# EAGLE schematic carberry (EAGLE 6.4)
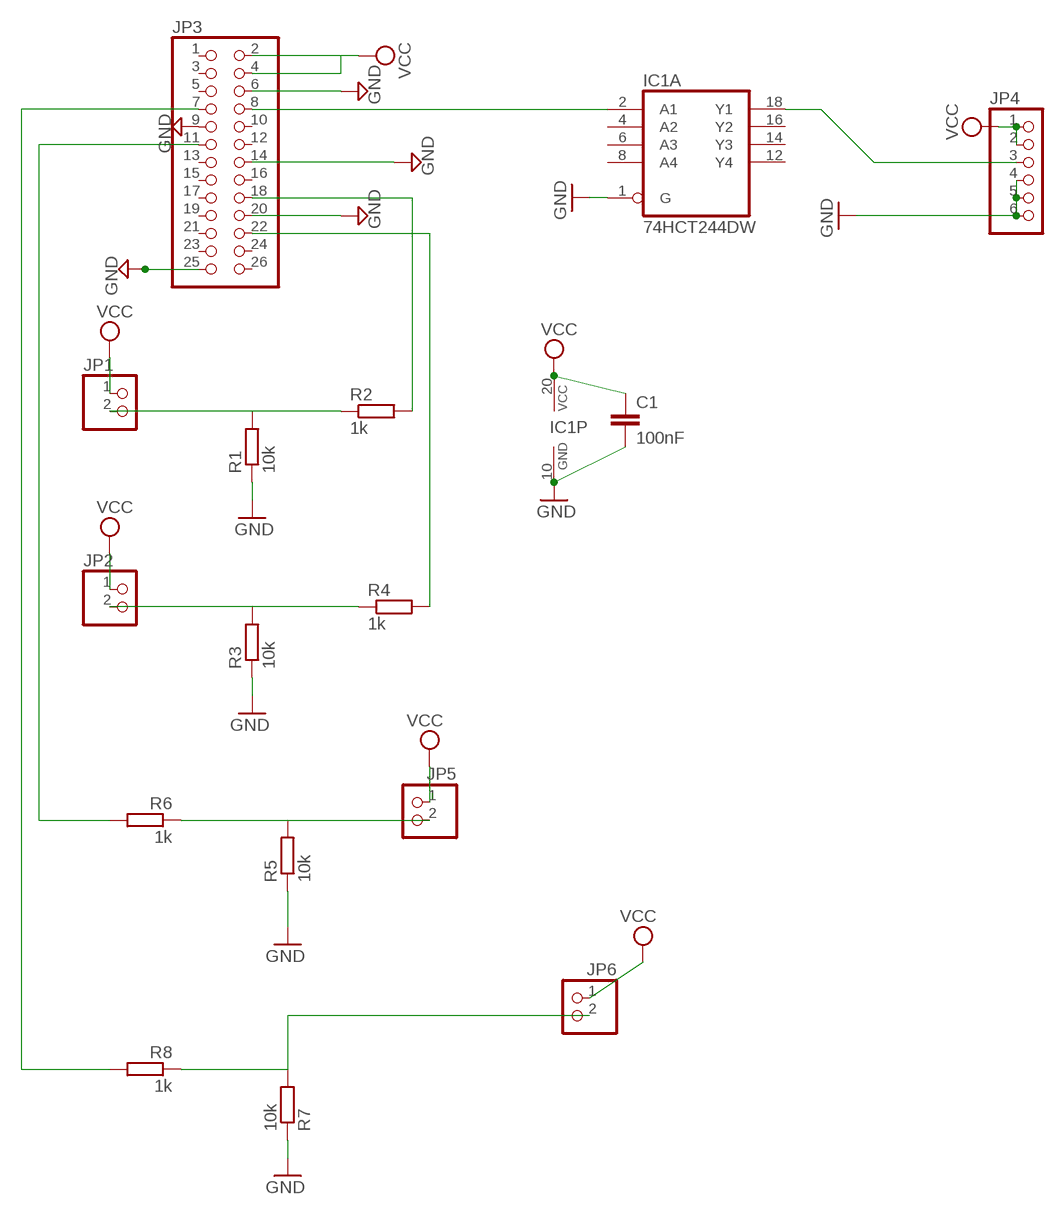
[diagram p0: schematic, sheet 1]

## Parts
C1  100nF  C-EUC0603K  [C0603K]
IC1  74HCT244DW  [SO20W]
JP1  PINHD-1X2  [1X02]
JP2  PINHD-1X2  [1X02]
JP3  PINHD-2X13  [2X13]
JP4  PINHD-1X6  [1X06]
JP5  PINHD-1X2  [1X02]
JP6  PINHD-1X2  [1X02]
R1  10k  RR0603  [R0603]
R2  1k  RR0603  [R0603]
R3  10k  RR0603  [R0603]
R4  1k  RR0603  [R0603]
R5  10k  RR0603  [R0603]
R6  1k  RR0603  [R0603]
R7  10k  RR0603  [R0603]
R8  1k  RR0603  [R0603]

## Nets
GND: C1.2 IC1.1(A:G) IC1.10(P:GND) JP3.6 JP3.9 JP3.14 JP3.20 JP3.25 JP4.4 JP4.5 JP4.6 R1.1 R3.1 R5.1 R7.1
N$1: IC1.18(A:Y1) JP4.3
N$2: JP1.2 R1.2 R2.1
N$3: IC1.2(A:A1) JP3.8
N$4: JP2.2 R3.2 R4.1
N$5: JP5.2 R5.2 R6.1
N$6: JP6.2 R7.2 R8.1
N$7: JP3.18 R2.2
N$8: JP3.22 R4.2
N$9: JP3.11 R6.2
N$10: JP3.7 R8.2
VCC: C1.1 IC1.20(P:VCC) JP1.1 JP2.1 JP3.2 JP3.4 JP4.1 JP4.2 JP5.1 JP6.1
Unconnected: IC1.3(B:Y4) IC1.4(A:A2) IC1.5(B:Y3) IC1.6(A:A3) IC1.7(B:Y2) IC1.8(A:A4) IC1.9(B:Y1) IC1.11(B:A1) IC1.12(A:Y4) IC1.13(B:A2) IC1.14(A:Y3) IC1.15(B:A3) IC1.16(A:Y2) IC1.17(B:A4) IC1.19(B:G) JP3.1 JP3.3 JP3.5 JP3.10 JP3.12 JP3.13 JP3.15 JP3.16 JP3.17 JP3.19 JP3.21 JP3.23 JP3.24 JP3.26

## Library data of the parts
C1 = resistor:C-EU: CAPACITOR, European symbol
IC1 = 74xx-eu:74*244: Octal BUFFER and LINE DRIVER, 3-state
JP1 JP2 JP5 JP6 = pinhead:PINHD-1X2: PIN HEADER
JP3 = pinhead:PINHD-2X13: PIN HEADER
JP4 = pinhead:PINHD-1X6: PIN HEADER
R1-R8 = eagle-ltspice:R: RESISTOR, European symbol; SPICEMODEL: NONE; SPICEPREFIX: R